# EAGLE design main_box pcb v0 (EAGLE 9.7.0)
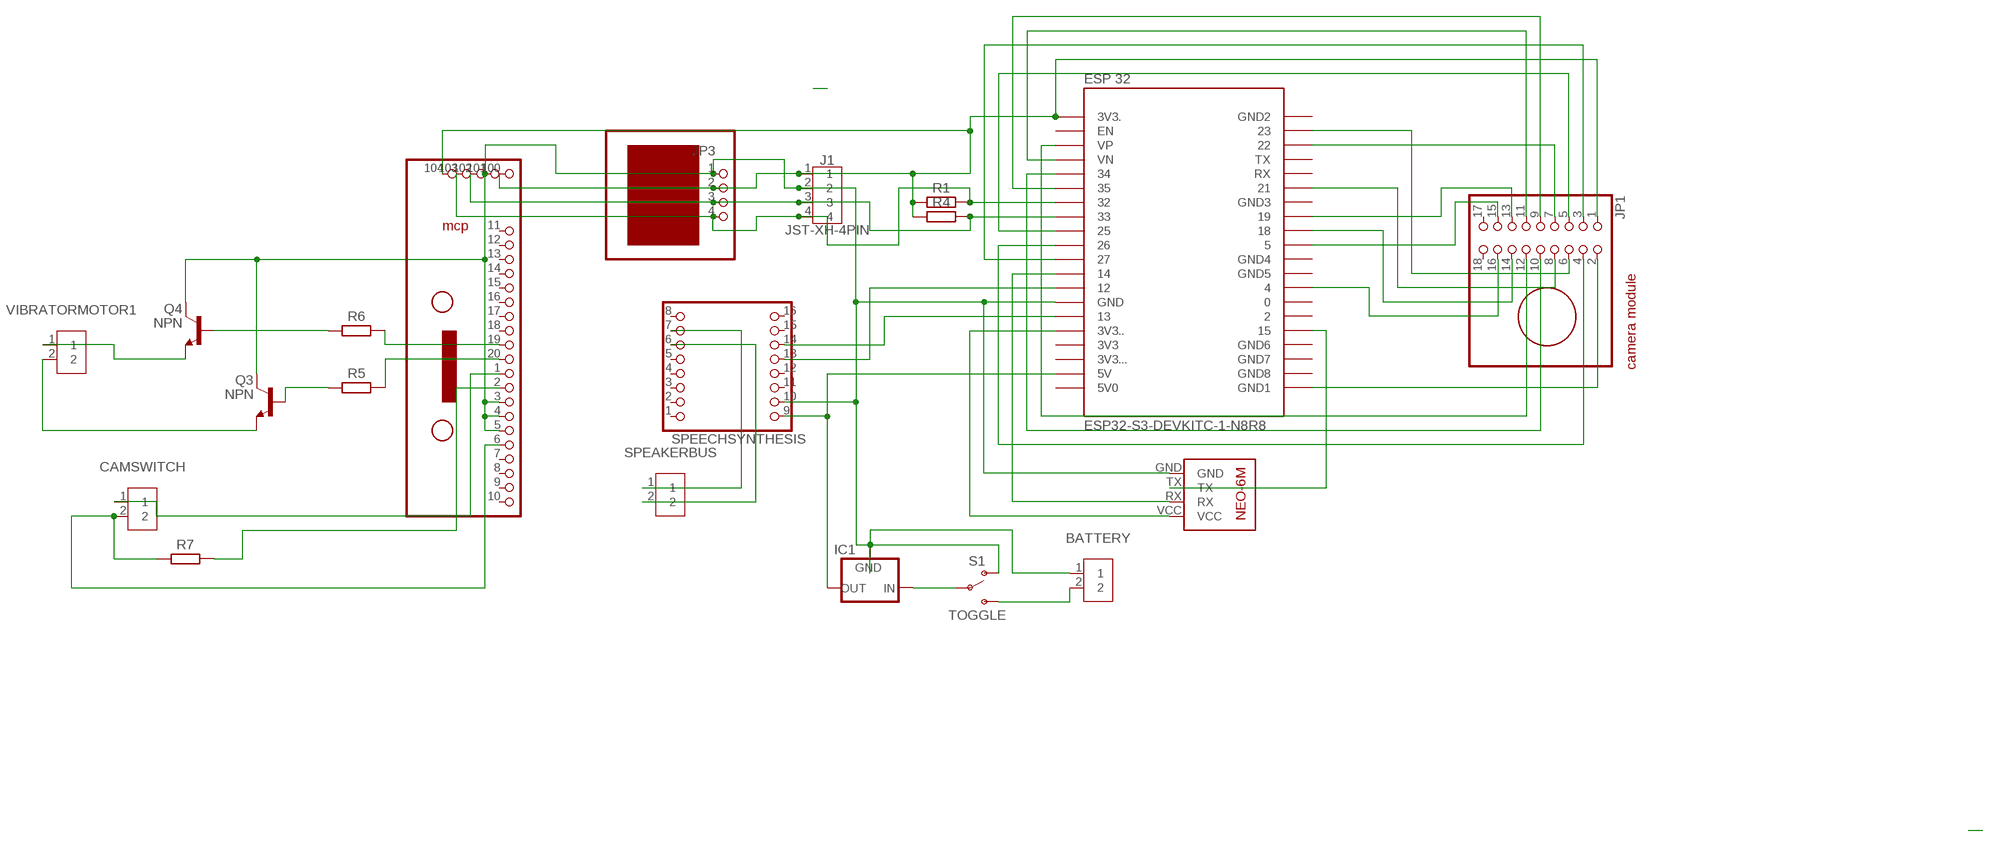
[diagram p0: schematic, sheet 1]

## Parts
BATTERY  JST-VH-2PIN  B2P-VH  [B2P-VH_396-2N]
CAMSWITCH  JST-VH-2PIN  B2P-VH  [B2P-VH_396-2N]
IC1  78MXXS  [78MXXS]
J1  JST-XH-4PIN  B4B-XH-A  [B4B-XH-A]
JP1  PINHD-2X9  [2X09]
JP3  PINHD-1X4  [1X04]
JP5  PINHD-1X10  [1X10]
Q3  NPN  NPN_TO92-EBC  [TO92]
Q4  NPN  NPN_TO92-EBC  [TO92]
R1  RESISTOR__AXIAL-11.7MM-PITCH  [RESAD1176W63L850D250B]
R4  RESISTOR__AXIAL-11.7MM-PITCH  [RESAD1176W63L850D250B]
R5  RESISTOR__AXIAL-7.2MM-PITCH  [RESAD724W46L381D178B]
R6  RESISTOR__AXIAL-7.2MM-PITCH  [RESAD724W46L381D178B]
R7  RESISTOR__AXIAL-7.2MM-PITCH  [RESAD724W46L381D178B]
S1  TOGGLE  [SWITCH-SPDT-PTH-8.5X3.7MM]
SPEAKERBUS  JST-VH-2PIN  B2P-VH  [B2P-VH_396-2N]
SPEECHSYNTHESIS  PINHD-1X8  [1X08]
U$1  ESP32-S3-DEVKITC-1-N8R8  [ESP32-S3-DEVKITC-1-N8R8]
U$2  NEO-6M  [NEO-6M]
VIBRATORMOTOR1  JST-VH-2PIN  B2P-VH  [B2P-VH_396-2N]

## Nets
N$1: IC1.OUT SPEECHSYNTHESIS.9(VCC) U$1.J1_20(5V)
N$3: JP1.2(GND) U$1.J3_21(GND1)
N$4: JP1.3(SIOC) U$1.J1_12
N$5: JP1.4(SIOD) U$1.J1_11
N$6: JP1.5(VSYNC) U$1.J1_10
N$7: JP1.6(HREF) U$1.J3_3
N$8: JP1.7(PCLK) U$1.J3_4
N$9: JP1.8(XCLK) U$1.J3_7
N$10: JP1.9(D9) U$1.J1_7
N$11: JP1.10(D8) U$1.J1_6
N$12: JP1.11(D7) U$1.J1_5(VN)
N$13: JP1.12(D6) U$1.J1_4(VP)
N$14: JP1.13(D5) U$1.J3_9
N$15: JP1.14(D4) U$1.J3_10
N$16: JP1.15(D2) U$1.J3_11
N$17: JP1.16(D1) U$1.J3_14
N$18: U$1.J1_17(3V3..) U$2.VCC
N$19: J1.4 JP3.4 JP5.103 R1.2 U$1.J1_8
N$20: J1.3 JP3.3 JP5.102 R4.2 U$1.J1_9
N$21: SPEAKERBUS.1 SPEECHSYNTHESIS.7(GND1)
N$22: JP5.20(PB0) R5.2
N$24: JP5.19(PB1) R6.2
N$25: IC1.IN S1.2(P)
N$26: U$1.J3_17 U$2.TX
N$27: U$1.J1_13 U$2.RX
N$28: BATTERY.2 S1.3(S)
N$29: SPEECHSYNTHESIS.13(DAC_L) U$1.J1_14
N$30: SPEECHSYNTHESIS.14(SPK_1) U$1.J1_16
N$31: BATTERY.1 IC1.GND J1.2 JP3.1 JP5.3(PA0) JP5.4(PA1) JP5.5(PA2) JP5.101 Q3.3(C) Q4.3(C) S1.1(O) SPEECHSYNTHESIS.10(RX) U$1.J1_15(GND) U$2.GND
N$32: SPEAKERBUS.2 SPEECHSYNTHESIS.6(IO_2)
N$36: J1.1 JP1.1(3.3) JP3.2 JP5.100 JP5.104 R1.1 R4.1 U$1.J1_2(3V3.)
N$42: Q4.2(B) R6.1
N$44: Q3.2(B) R5.1
N$45: Q3.1(E) VIBRATORMOTOR1.2
N$46: Q4.1(E) VIBRATORMOTOR1.1
N$47: CAMSWITCH.1 JP5.1(VCC)
N$48: JP5.2(GND) R7.2
N$50: CAMSWITCH.2 JP5.6(PA3) R7.1
Unconnected: JP1.17(RET) JP1.18(PWDN) JP5.7(PA4) JP5.8(PA5) JP5.9(PA6) JP5.10(PA7) JP5.11(VCC1) JP5.12 JP5.13(PB7) JP5.14(PB6) JP5.15(PB5) JP5.16(PB4) JP5.17(PB3) JP5.18(PB2) SPEECHSYNTHESIS.1(BUSY) SPEECHSYNTHESIS.2(USB-) SPEECHSYNTHESIS.3(USB+) SPEECHSYNTHESIS.4(ADKEY_2) SPEECHSYNTHESIS.5(ADKEY_1) SPEECHSYNTHESIS.8(IO_1) SPEECHSYNTHESIS.11(TX) SPEECHSYNTHESIS.12(DAC_R) SPEECHSYNTHESIS.15(GND) SPEECHSYNTHESIS.16(SPK_2) U$1.J1_3(EN) U$1.J1_18(3V3) U$1.J1_19(3V3...) U$1.J3_2(GND2) U$1.J3_5(TX) U$1.J3_6(RX) U$1.J3_8(GND3) U$1.J3_12(GND4) U$1.J3_13(GND5) U$1.J3_15 U$1.J3_16 U$1.J3_18(GND6) U$1.J3_19(GND7) U$1.J3_20(GND8)

## Power pins joined to a net without a drawn wire
5V0: U$1.J1_21(5V0)

## Library data of the parts
BATTERY CAMSWITCH SPEAKERBUS VIBRATORMOTOR1 = Connector:B2P-VH: VH Connector Top Entry - 2POS, 3.96MM Details see: Datasheet <http://www.jst-mfg.com/product/pdf/eng/eVH.pdf>; CATEGORY: Header; DESCRIPTION: Connector Header Through Hole 2 position 0.156" (3.96mm); MANUFACTURER: JST Sales America Inc.; MPN: B2P-VH; OPERATING_TEMPERATURE: -25°C ~ 85°C; PART_STATUS: Active; PITCH: 0.156" (3.96mm); ROHS_COMPLIANCE: RoHS non-compliant; SERIES: VH; SUBCATEGORY: Rectangular Connectors; TYPE: Header, Male Pin, Board to Cable/Wire, Through Hole
IC1 = v-reg:78MXXS: VOLTAGE REGULATOR
J1 = Connector:B4B-XH-A: XH Connector Top Entry - 4POS Details see: Datasheet <http://www.jst-mfg.com/product/pdf/eng/eXH.pdf>; CATEGORY: Header; DSECRIPTION: Connector Header Through Hole 4 position 0.098" (2.50mm); MANUFACTURER: JST Sales America Inc.; MPN: B4B-XH-A(LF)(SN); OPERATING_TEMPERATURE: -25 C to 85 C; PART_STATUS: ACTIVE; PITCH: 0.098" (2.50mm); ROHS_COMPLIANCE: ROHS3 Compliant; SERIES: XH; SUB_CATEGORY: Rectangular Connectors; TYPE: Header, Male Pin, Board to Cable/Wire, Through Hole
JP1 = camera module:PINHD-2X9: PIN HEADER
JP3 = camera module:PINHD-1X4: PIN HEADER
JP5 = camera module:PINHD-1X10: PIN HEADER
Q3 Q4 = Transistor:NPN: NPN - Generic; CATEGORY: Transistor; SUB-CATEGORY: BJT; TYPE: NPN
R1 R4-R7 = Tinkercad:RESISTOR: Resistor Fixed - Generic; CATEGORY: Resistor; SUB-CATEGORY: Fixed
S1 = Tinkercad:TOGGLE
SPEECHSYNTHESIS = speech synthesis:PINHD-1X8: PIN HEADER
U$1 = ESP32-S3-DEVKITC-1-N8R8:ESP32-S3-DEVKITC-1-N8R8; CHECK_PRICES: https://www.snapeda.com/parts/ESP32-S3-DEVKITC-1-N8R8/Espressif+Systems/view-part/?ref=eda; DESCRIPTION: The ESP32-S3-DEVKITC-1-N8R8 from Espressif Systems is a development board designed for RF, RFID, and wireless applications. It supports 802.11 b/g/n Wi-Fi and Bluetooth® 5.x (BLE) connectivity at 2.4GHz, making it ideal for IoT and wireless communication projects. This board is powered by the ESP32-S3-WROOM-1-N8R8 module, which features 8MB Quad SPI Flash and 8MB Octal SPI for efficient memory storage and processing.; DIGIKEY_PART_NUMBER: 1965-ESP32-S3-DEVKITC-1-N8R8-ND; MF: Espressif Systems; MP: ESP32-S3-DEVKITC-1-N8R8; PACKAGE: None; SNAPEDA_LINK: https://www.snapeda.com/parts/ESP32-S3-DEVKITC-1-N8R8/Espressif+Systems/view-part/?ref=snap
U$2 = NEO-6M:NEO-6M: Check availability <https://pricing.snapeda.com/parts/NEO-6M/U-blox/view-part?ref=eda>; AVAILABILITY: In Stock; CHECK_PRICES: https://www.snapeda.com/parts/NEO-6M/u-blox/view-part/?ref=eda; MF: U-blox; MP: NEO-6M; PACKAGE: None; PRICE: None; SNAPEDA_LINK: https://www.snapeda.com/parts/NEO-6M/u-blox/view-part/?ref=snap

## Board
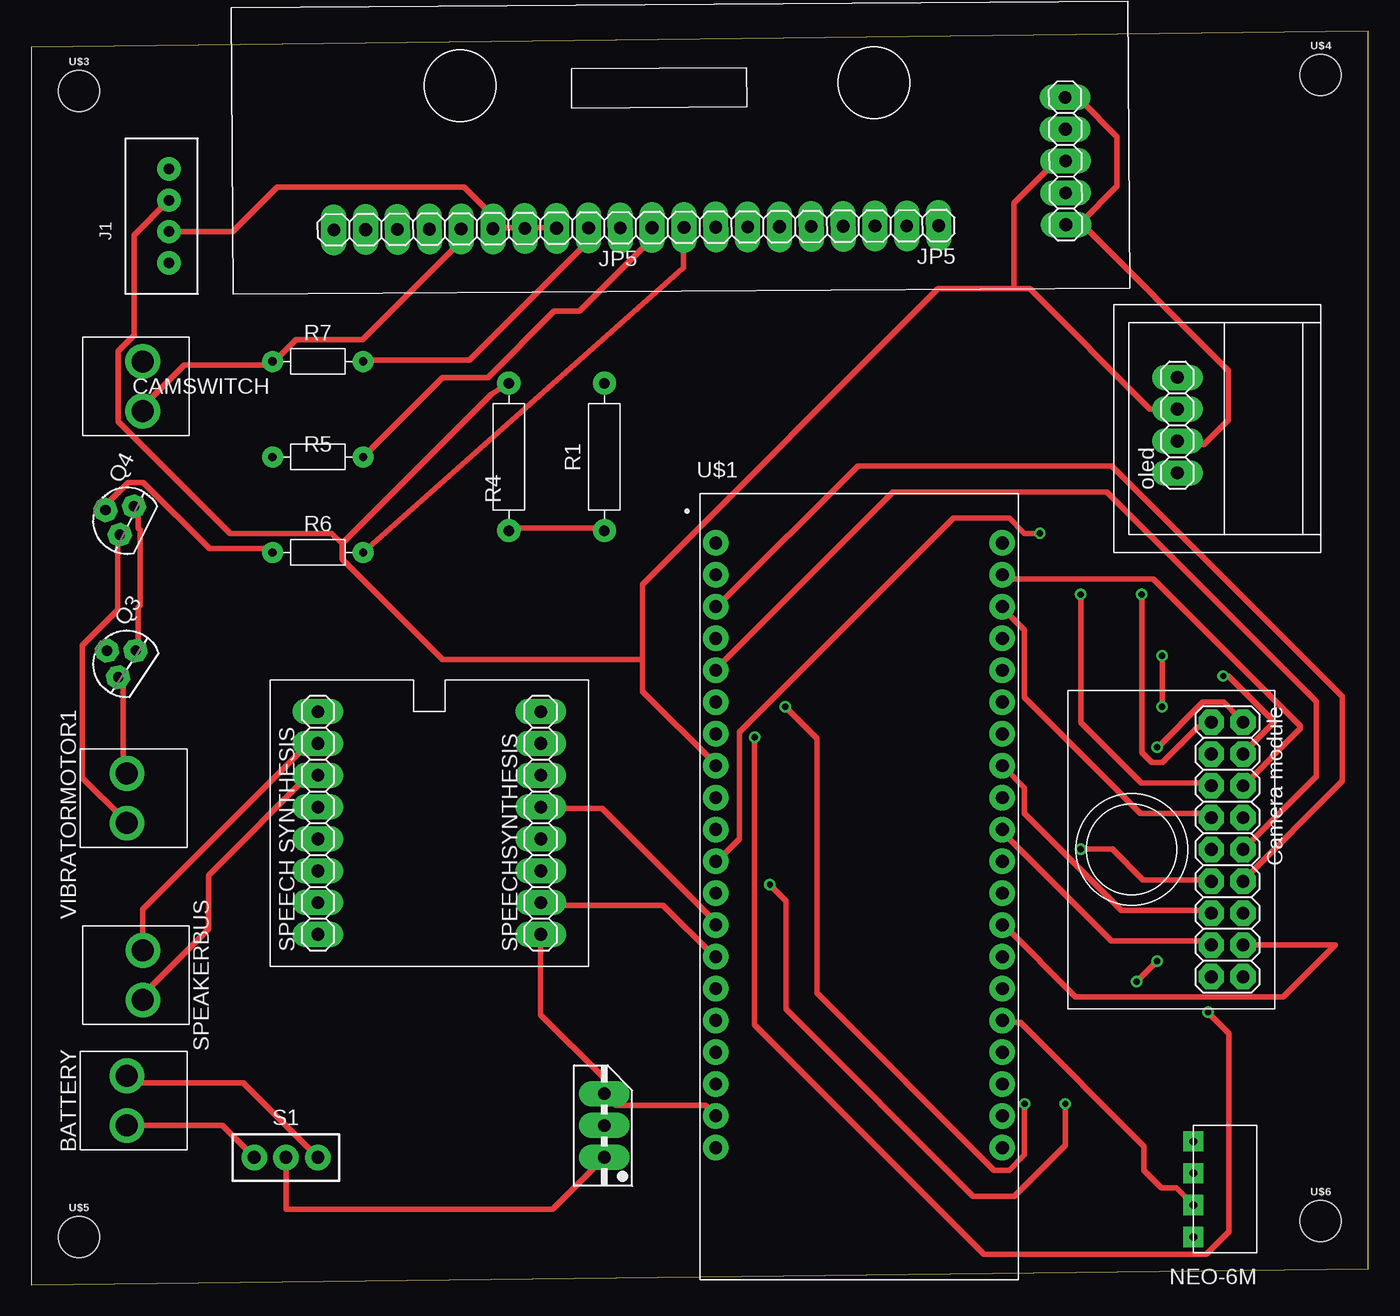
[diagram p1: board, top side]
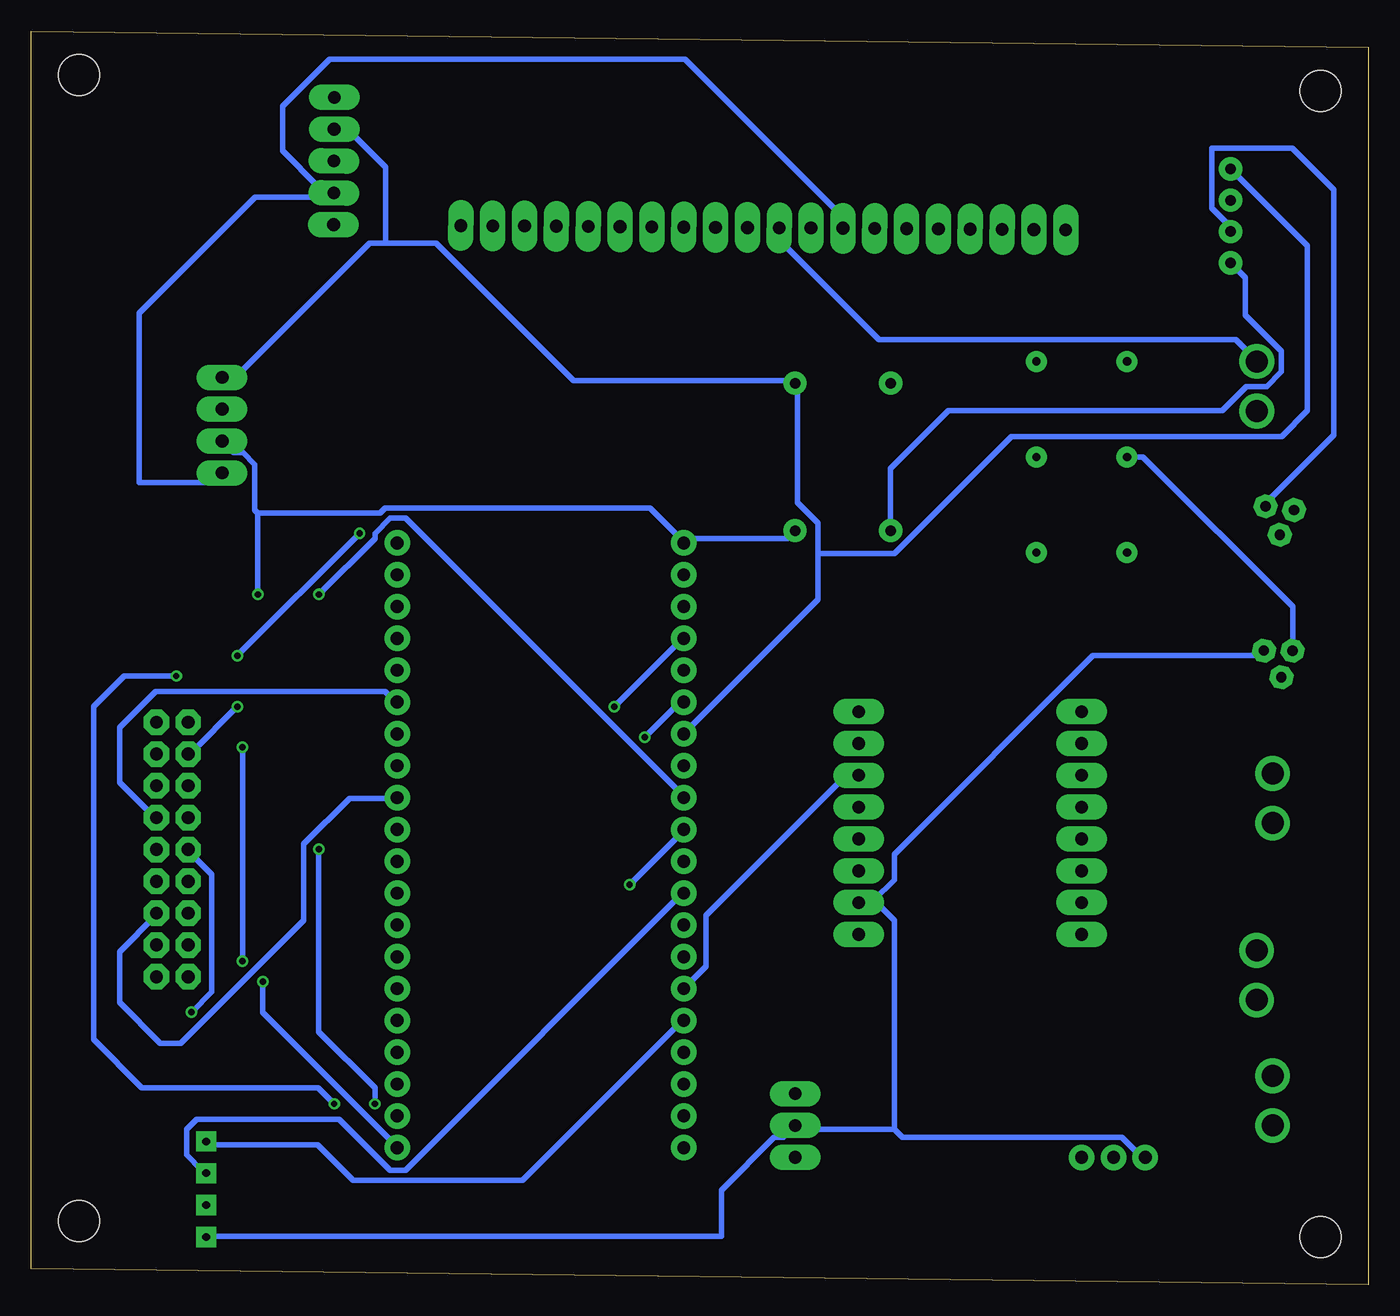
[diagram p2: board, bottom side, seen from below]

Size 106.66 x 100 mm. Coordinates in mm from the lower left corner, seen from the top.
Outline: 0,0 106.66,1.27 106.66,100 0,98.73 0,0
Copper layers (1*16): Top / Bottom
Stack-up Default Layer Stack: Top SilkScreen Epoxy Ink / Top SolderMask SR:Green 0.0254mm Dk 4.3 / Top Surface Finish Lead-Free 0.02mm / Top CuFoil:007 0.035mm / Dielectric-1 User Defined 1.5mm / Bottom CuFoil:007 0.035mm / Bottom Surface Finish Lead-Free 0.02mm / Bottom SolderMask SR:Green 0.0254mm Dk 4.3 / Bottom SilkScreen Epoxy Ink
Design rules: minimum drill size 20mil, minimum copper width 18mil, keepout clearance 0mil, drill distance 20mil, via restrict clearance 0mil, dimension clearance 40mil, restrict clearance 0mil, copper clearance wire_polygon to wire_polygon 14mil, copper clearance wire_polygon to pad_smd 14mil, copper clearance wire_polygon to via 14mil, copper clearance pad_smd to pad_smd 14mil, copper clearance pad_smd to via 14mil, copper clearance via to via 14mil, copper clearance smd to pad (same net) 14mil, copper clearance smd to via (same net) 14mil, copper clearance smd to smd (same net) 14mil

### Footprints (pad centres in the part's own frame; a part is rotated, then mirrored left to right if it is on the bottom)
B2P-VH_396-2N = drill 1.75: 1 0,0; 2 3.96,0
78MXXS = drill 1.016 long: GND 0,-2.54; IN -2.54,-2.54; OUT 2.54,-2.54
B4B-XH-A = drill 0.84: 1 0,0; 2 2.5,0; 3 5,0; 4 7.5,0
2X09 = drill 1.016 octagon: 1 -10.16,-1.27; 2 -10.16,1.27; 3 -7.62,-1.27; 4 -7.62,1.27; 5 -5.08,-1.27; 6 -5.08,1.27; 7 -2.54,-1.27; 8 -2.54,1.27; 9 0,-1.27; 10 0,1.27; 11 2.54,-1.27; 12 2.54,1.27; 13 5.08,-1.27; 14 5.08,1.27; 15 7.62,-1.27; 16 7.62,1.27; 17 10.16,-1.27; 18 10.16,1.27
1X04 = drill 1.016 long: 1 -3.81,0; 2 -1.27,0; 3 1.27,0; 4 3.81,0
1X10 = drill 1.016 long: 1 -11.43,0; 2 -8.89,0; 3 -6.35,0; 4 -3.81,0; 5 -1.27,0; 6 1.27,0; 7 3.81,0; 8 6.35,0; 9 8.89,0; 10 11.43,0; 11 -36.83,0; 12 -34.29,0; 13 -31.75,0; 14 -29.21,0; 15 -26.67,0; 16 -24.13,0; 17 -21.59,0; 18 -19.05,0; 19 -16.51,0; 20 -13.97,0; 100 -46.99,0; 101 -46.99,-2.54; 102 -46.99,-5.08; 103 -46.99,-7.62; 104 -46.99,-10.16
TO92 = drill 0.813 octagon: 1 -1.27,0; 2 0,1.905; 3 1.27,0
RESAD1176W63L850D250B = drill 0.83 pad 1.43: 1 -5.88,0; 2 5.88,0
RESAD724W46L381D178B = drill 0.66 pad 1.26: 1 -3.62,0; 2 3.62,0
SWITCH-SPDT-PTH-8.5X3.7MM = drill 1.016 pad 1.88: 1 -2.54,0; 2 0,0; 3 2.54,0
1X08 = drill 1.016 long: 1 -10.16,2.54; 2 -7.62,2.54; 3 -5.08,2.54; 4 -2.54,2.54; 5 0,2.54; 6 2.54,2.54; 7 5.08,2.54; 8 7.62,2.54; 9 -10.16,-15.24; 10 -7.62,-15.24; 11 -5.08,-15.24; 12 -2.54,-15.24; 13 0,-15.24; 14 2.54,-15.24; 15 5.08,-15.24; 16 7.62,-15.24
ESP32-S3-DEVKITC-1-N8R8 = drill 1.02: J1_2 -11.43,27.43; J1_3 -11.43,24.89; J1_4 -11.43,22.35; J1_5 -11.43,19.81; J1_6 -11.43,17.27; J1_7 -11.43,14.73; J1_8 -11.43,12.19; J1_9 -11.43,9.65; J1_10 -11.43,7.11; J1_11 -11.43,4.57; J1_12 -11.43,2.03; J1_13 -11.43,-0.51; J1_14 -11.43,-3.05; J1_15 -11.43,-5.59; J1_16 -11.43,-8.13; J1_17 -11.43,-10.67; J1_18 -11.43,-13.21; J1_19 -11.43,-15.75; J1_20 -11.43,-18.29; J1_21 -11.43,-20.83; J3_2 11.43,27.43; J3_3 11.43,24.89; J3_4 11.43,22.35; J3_5 11.43,19.81; J3_6 11.43,17.27; J3_7 11.43,14.73; J3_8 11.43,12.19; J3_9 11.43,9.65; J3_10 11.43,7.11; J3_11 11.43,4.57; J3_12 11.43,2.03; J3_13 11.43,-0.51; J3_14 11.43,-3.05; J3_15 11.43,-5.59; J3_16 11.43,-8.13; J3_17 11.43,-10.67; J3_18 11.43,-13.21; J3_19 11.43,-15.75; J3_20 11.43,-18.29; J3_21 11.43,-20.83
NEO-6M = drill 0.6 square: GND -3.81,2.54; RX 1.27,2.54; TX -1.27,2.54; VCC 3.81,2.54
STAND-OFF = hole 3.302: 0,0

### Placement (x,y rotation side)
BATTERY  7.62,12.7 90 top
CAMSWITCH  8.89,73.66 270 top
IC1  43.18,12.7 90 top
J1  10.98,81.52 90 top
JP1  95.41,34.72 270 top
JP3  91.44,68.58 90 top
JP5  35.56,84.24 180.4 top
Q3  7.62,49.53 56.5 top
Q4  7.62,60.96 63.5 top
R1  45.72,66.04 90 top
R4  38.1,66.04 90 top
R5  22.86,66.04 0 top
R6  22.86,58.42 0 top
R7  22.86,73.66 0 top
S1  20.32,10.16 0 top
SPEAKERBUS  8.9,26.67 270 top
SPEECHSYNTHESIS  25.4,38.1 90 top
U$1  66.04,31.75 0 top
U$2  95.25,7.62 90 top
U$3  [STAND-OFF]  3.81,95.25 0 top
U$4  [STAND-OFF]  102.87,96.52 0 top
U$5  [STAND-OFF]  3.81,3.81 0 top
U$6  [STAND-OFF]  102.87,5.08 0 top
VIBRATORMOTOR1  7.62,36.83 90 top

### Tracks (layer width: path | path; a pad name or v marks a point on that pad's centre or on a via)
N$1
  Top 0.457: SPEECHSYNTHESIS.9 40.64,21.54 45.72,16.46 IC1.OUT 46.66,14.3 53.77,14.3 U$1.J1_20
N$3  (via drill 0.51)
  Top 0.457: v88.19,24.18 v89.81,25.81 | JP1.2 96.32,44.91 96.32,45.31 95.15,46.48 93.48,46.48 89.88,42.88 v89.81,42.88
  Bottom 0.457: v89.81,25.81 v89.81,42.88 | v88.19,24.18 88.19,21.74 77.62,11.18 U$1.J3_21
N$4  (via drill 0.51)
  Top 0.457: v90.22,50.19 v90.22,46.13 | v80.47,59.94 79.25,59.94 78.03,61.16 73.56,61.16 56.49,44.09 56.49,35.56 54.86,33.93 U$1.J1_12
  Bottom 0.457: v90.22,46.13 93.88,42.47 JP1.3 | v80.47,59.94 v90.22,50.19
N$5  (via drill 0.51)
  Top 0.457: v95.1,48.56 95.5,48.56 99.16,44.91 96.72,42.47 JP1.4 | v82.5,14.43 82.5,11.12 78.44,7.06 75.13,7.06 60.2,22 60.2,30.63 v58.93,31.9
  Bottom 0.457: v95.1,48.56 99.26,48.56 101.7,46.13 101.7,19.56 97.84,15.7 83.77,15.7 v82.5,14.43 | v58.93,31.9 54.86,35.97 U$1.J1_11
N$6  (via drill 0.51)
  Top 0.457: v83.72,55.07 83.72,44.86 88.54,40.03 93.88,40.03 JP1.5
  Bottom 0.457: v83.72,55.07 79.25,59.54 79.25,59.94 78.03,61.16 76.81,61.16 54.86,39.22 U$1.J1_10
N$7
  Top 0.457: U$1.J3_3 77.62,56.29 89.52,56.29 101.24,44.56 101.24,44.36 JP1.6
N$8
  Top 0.457: JP1.7 93.88,37.59 88.49,37.59 79.25,46.84 79.25,52.22 77.62,53.85 U$1.J3_4
N$9
  Bottom 0.457: JP1.8 96.72,37.59 97.13,37.59 99.62,40.08 99.62,44.45 96.72,47.35 78.44,47.35 77.62,46.53 U$1.J3_7
N$10  (via drill 0.51)
  Top 0.457: v93.88,21.74 95.56,20.07 95.56,4.21 93.76,2.42 76.02,2.42 57.71,20.73 v57.71,43.69
  Bottom 0.457: v93.88,21.74 92.25,23.37 92.25,32.72 93.88,34.34 JP1.9 | v57.71,43.69 54.86,46.53 U$1.J1_7
N$11
  Top 0.457: U$1.J1_6 54.86,49.38 68.73,63.25 85.8,63.25 102.51,46.53 102.51,40.55 JP1.10
N$12  (via drill 0.51)
  Top 0.457: v83.72,34.75 86.26,34.75 88.7,32.31 93.88,32.31 JP1.11 | v79.25,14.43 79.25,10.36 78.03,9.14 76.81,9.14 62.69,23.27 62.69,43.59 v60.15,46.13
  Bottom 0.457: v83.72,34.75 83.72,20.17 79.25,15.7 v79.25,14.43 | v60.15,46.13 54.86,51.41 U$1.J1_5
N$13
  Top 0.457: JP1.12 96.72,32.31 104.6,40.18 104.6,46.94 86.21,65.33 65.94,65.33 54.86,54.25 U$1.J1_4
N$14
  Top 0.457: JP1.13 93.88,29.87 86.97,29.87 79.25,37.59 79.25,39.62 77.62,41.25 U$1.J3_9
N$15
  Bottom 0.457: JP1.14 96.72,29.46 99.62,26.57 99.62,22.5 96.37,19.25 94.74,19.25 84.94,29.06 84.94,35.15 81.28,38.81 77.62,38.81 U$1.J3_10
N$16
  Top 0.457: JP1.15 93.88,27.43 86.16,27.43 77.62,35.97 U$1.J3_11
N$17
  Top 0.457: U$1.J3_14 77.62,28.65 83.31,22.96 99.89,22.96 104.03,27.1 JP1.16
N$18
  Bottom 0.457: U$2.VCC 92.66,11.18 83.82,11.18 80.97,8.33 67.46,8.33 54.86,20.93 U$1.J1_17
N$19
  Bottom 0.457: 78.38,83.11 78.38,89.15 81.28,92.05 82.09,92.05 JP5.103 | JP3.4 90.11,72.66 79.65,83.11 78.38,83.11 | 43.89,58.32 43.89,54.66 54.46,44.09 U$1.J1_8 | 43.89,58.32 43.89,60.76 45.52,62.38 45.52,71.73 R1.2 45.92,72.14 63.4,72.14 74.37,83.11 78.38,83.11 | 43.89,58.32 37.8,58.32 28.45,67.67 6.91,67.67 4.84,69.73 4.84,82.89 J1.4
N$20
  Top 0.457: 78.38,79.45 78.38,86.31 81.69,89.61 82.5,89.61 JP5.102 | 24.79,59.13 36.71,71.05 R4.2 | 24.79,59.13 24.79,57.91 32.82,49.89 48.77,49.89 | U$1.J1_9 54.46,41.66 48.77,47.35 48.77,49.89 | 24.79,59.13 23.98,59.94 15.85,59.94 6.92,68.87 6.92,74.47 8.19,75.75 8.19,83.74 J1.3 | 78.38,79.45 72.34,79.45 48.77,55.88 48.77,49.89 | 78.38,79.45 79.65,79.45 89.26,69.85 JP3.3
N$21
  Top 0.457: SPEECHSYNTHESIS.7 22.49,43.55 8.9,29.96 SPEAKERBUS.1
N$22
  Top 0.457: R5.2 32.83,72.39 36.42,72.39 41.71,77.67 43.74,77.67 49.17,83.11 49.17,84.33 JP5.20
N$24
  Top 0.457: R6.2 52.02,81.16 52.02,84.33 JP5.19
N$25
  Top 0.457: S1.2 20.32,6.02 41.58,6.02 IC1.IN
N$26
  Top 0.457: U$1.J3_17 77.62,20.93 78.89,20.93 88.78,11.04 88.78,9.11 90.17,7.72 91.34,7.72 U$2.TX
N$27
  Bottom 0.457: U$2.RX 93.07,9.14 94.28,10.36 94.28,12.39 93.47,13.21 82.09,13.21 78.03,9.14 76.81,9.14 54.86,31.09 U$1.J1_13
N$28
  Top 0.457: BATTERY.2 8.16,16.12 16.9,16.12 S1.3
N$29
  Top 0.457: SPEECHSYNTHESIS.13 40.64,38 45.52,38 54.46,29.06 U$1.J1_14
N$30
  Bottom 0.457: SPEECHSYNTHESIS.14 40.64,40.44 41.86,40.44 52.83,29.46 52.83,25.4 54.46,23.77 U$1.J1_16
N$31
  Top 0.457: JP5.3 41.86,84.33 39.42,84.33 JP5.4 39.01,84.33 36.98,84.33 JP5.5 36.58,84.33 36.58,85.55 34.54,87.58 19.61,87.58 16.06,84.02 J1.2 | Q4.3 8.53,61.98 8.53,60.35 8.67,60.21 8.67,54.19 8.53,54.05 8.53,50.6 Q3.3 | SPEECHSYNTHESIS.10 40.64,30.28 50.39,30.28 54.46,26.21 U$1.J1_15 | S1.1 15.24,12.7 BATTERY.1
  Bottom 0.457: 83.72,86.77 88.8,86.77 98.04,77.52 98.04,64.01 92.2,64.01 JP3.1 | 83.72,86.77 82.91,86.77 JP5.101 83.72,86.77 | 83.72,86.77 83.72,87.58 86.61,90.47 86.61,94.03 82.86,97.79 54.51,97.79 42.27,85.55 42.27,84.33 JP5.3 | 39.42,30.68 37.8,32.31 37.8,34.34 21.95,50.19 8.53,50.19 Q3.3 | 39.42,30.68 40.64,30.68 SPEECHSYNTHESIS.10 39.42,30.68 | U$2.GND 92.66,3.86 51.61,3.86 51.61,7.55 47.4,11.76 46.66,11.76 IC1.GND 45.67,12.39 37.8,12.39 | 39.42,30.68 37.8,29.06 37.8,12.39 | Q4.3 8.13,62.38 2.74,67.77 2.74,87.38 6.04,90.68 12.49,90.68 12.49,85.89 10.98,84.38 J1.2 | 37.8,12.39 37.16,11.76 19.66,11.76 18.06,10.16 S1.1
N$32
  Top 0.457: SPEAKERBUS.2 9.64,23.45 9.64,23.89 14.14,28.39 14.14,32.66 22.45,40.97 22.53,40.97 SPEECHSYNTHESIS.6
N$36  (via drill 0.51)
  Top 0.457: 83.72,84.73 82.91,84.73 JP5.100 83.72,84.73 | 83.72,84.73 86.61,87.63 86.61,91.59 83.72,94.49 82.5,94.49 JP5.104 | 83.72,84.73 95.5,72.95 95.5,68.99 93.53,67.01 JP3.2 | v88.59,55.07 88.59,42.47 89.41,41.66 90.22,41.66 93.07,44.5 93.88,44.5 JP1.1 | R4.1 38.2,60.35 45.52,60.35 R1.1
  Bottom 0.457: 88.59,61.57 v88.59,55.07 | R4.1 38.1,65.13 33.48,69.75 11.62,69.75 9.71,71.67 8.1,71.67 6.92,72.84 6.92,74.47 9.8,77.36 9.8,80.35 J1.1 | R1.1 45.92,59.94 46.33,59.54 54.46,59.54 U$1.J1_2 54.86,59.54 57.3,61.98 78.44,61.98 78.84,61.57 88.59,61.57 | 88.59,61.57 88.82,61.8 88.82,65.43 89.76,66.37 90.5,66.37 JP3.2
N$42
  Top 0.457: R6.1 19.1,58.73 14.22,58.73 8.94,64.01 7.72,64.01 5.69,61.98 Q4.2
N$44
  Bottom 0.457: Q3.2 6.03,54.09 17.98,66.04 R5.1
N$45
  Top 0.457: Q3.1 7.32,48.16 7.32,40.84 VIBRATORMOTOR1.2
N$46
  Top 0.457: Q4.1 6.91,59.54 6.91,53.85 4.06,51 4.06,40.44 7.32,37.19 VIBRATORMOTOR1.1
N$47
  Bottom 0.457: JP5.1 46.74,83.92 46.74,83.11 39.01,75.39 10.57,75.39 8.94,73.76 CAMSWITCH.1
N$48
  Top 0.457: R7.2 26.82,73.76 34.95,73.76 44.3,83.11 44.3,83.92 JP5.2
N$50
  Top 0.457: CAMSWITCH.2 8.94,70.1 12.19,73.36 19.1,73.36 R7.1 19.51,73.76 21.13,75.39 26.42,75.39 34.14,83.11 34.14,83.92 JP5.6